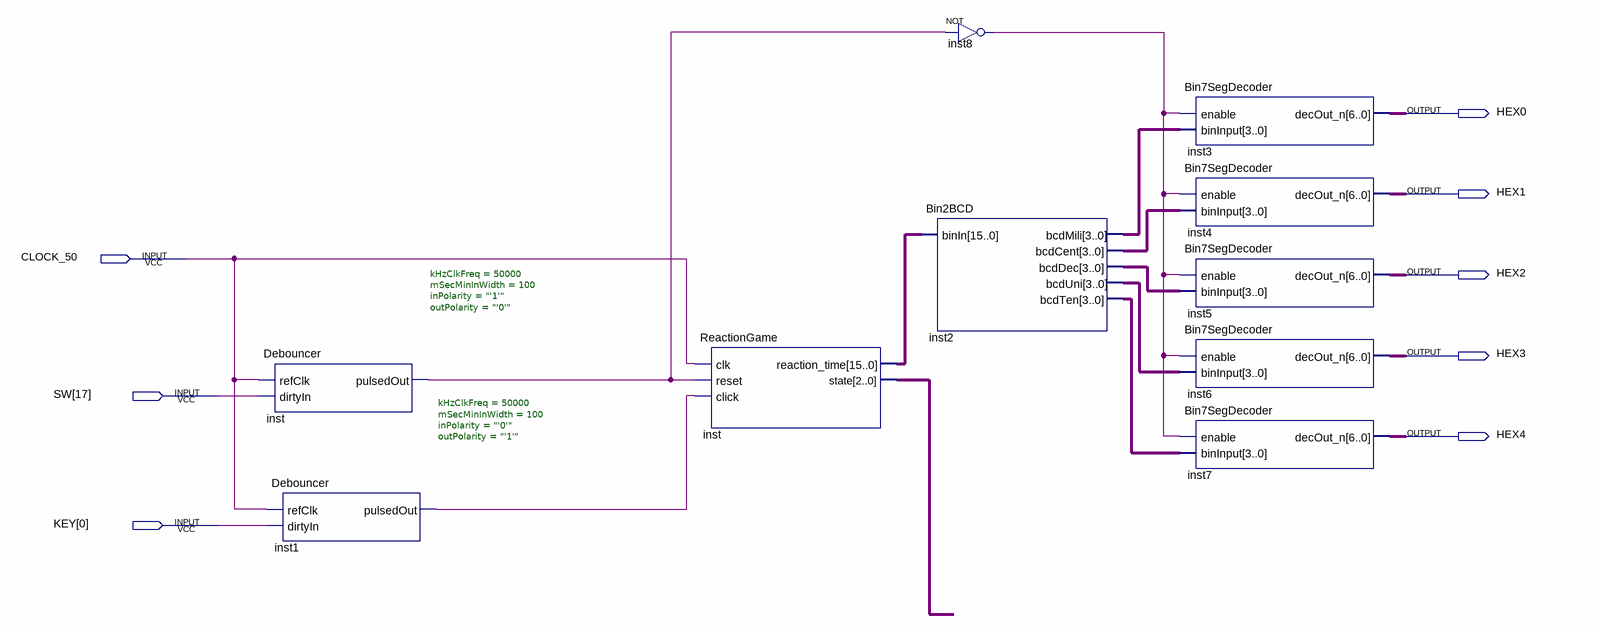
[diagram p0: schematic sheet]
// Quartus schematic demo_schematic.bdf as structural Verilog: 10 symbols, 8 pins
module demo_schematic (
  input  CLOCK_50,
  input  [17:17] SW,
  input  [0:0] KEY,
  output HEX0,
  output HEX1,
  output HEX2,
  output HEX3,
  output HEX4
);

  wire inst1_pulsedout, inst8_out, inst_pulsedout;
  wire [2:0] inst_state;
  wire [3:0] inst2_bcdcent, inst2_bcddec, inst2_bcdmili, inst2_bcdten, inst2_bcduni;
  wire [6:0] inst3_decout_n, inst4_decout_n, inst5_decout_n, inst6_decout_n, inst7_decout_n;
  wire [15:0] inst_reaction_time;

  Debouncer #(.kHzClkFreq(50000), .mSecMinInWidth(100), .inPolarity("'1'"), .outPolarity("'0'")) inst (
    .refClk(CLOCK_50), .dirtyIn(SW[17]), .pulsedOut(inst_pulsedout));
  Debouncer #(.kHzClkFreq(50000), .mSecMinInWidth(100), .inPolarity("'0'"), .outPolarity("'1'")) inst1 (
    .refClk(CLOCK_50), .dirtyIn(KEY[0]), .pulsedOut(inst1_pulsedout));
  ReactionGame inst_dup2 (
    .clk(CLOCK_50), .reset(inst_pulsedout), .click(inst1_pulsedout), .reaction_time(inst_reaction_time),
    .state(inst_state));
  Bin2BCD inst2 (
    .binIn(inst_reaction_time), .bcdMili(inst2_bcdmili), .bcdCent(inst2_bcdcent), .bcdDec(inst2_bcddec),
    .bcdUni(inst2_bcduni), .bcdTen(inst2_bcdten));
  not inst8 (inst8_out, inst_pulsedout);
  Bin7SegDecoder inst3 (.enable(inst8_out), .binInput(inst2_bcdmili), .decOut_n(inst3_decout_n));
  Bin7SegDecoder inst4 (.enable(inst8_out), .binInput(inst2_bcdcent), .decOut_n(inst4_decout_n));
  Bin7SegDecoder inst5 (.enable(inst8_out), .binInput(inst2_bcddec), .decOut_n(inst5_decout_n));
  Bin7SegDecoder inst6 (.enable(inst8_out), .binInput(inst2_bcduni), .decOut_n(inst6_decout_n));
  Bin7SegDecoder inst7 (.enable(inst8_out), .binInput(inst2_bcdten), .decOut_n(inst7_decout_n));
endmodule
